# EAGLE design TD4Peripheral (EAGLE 9.2.2)
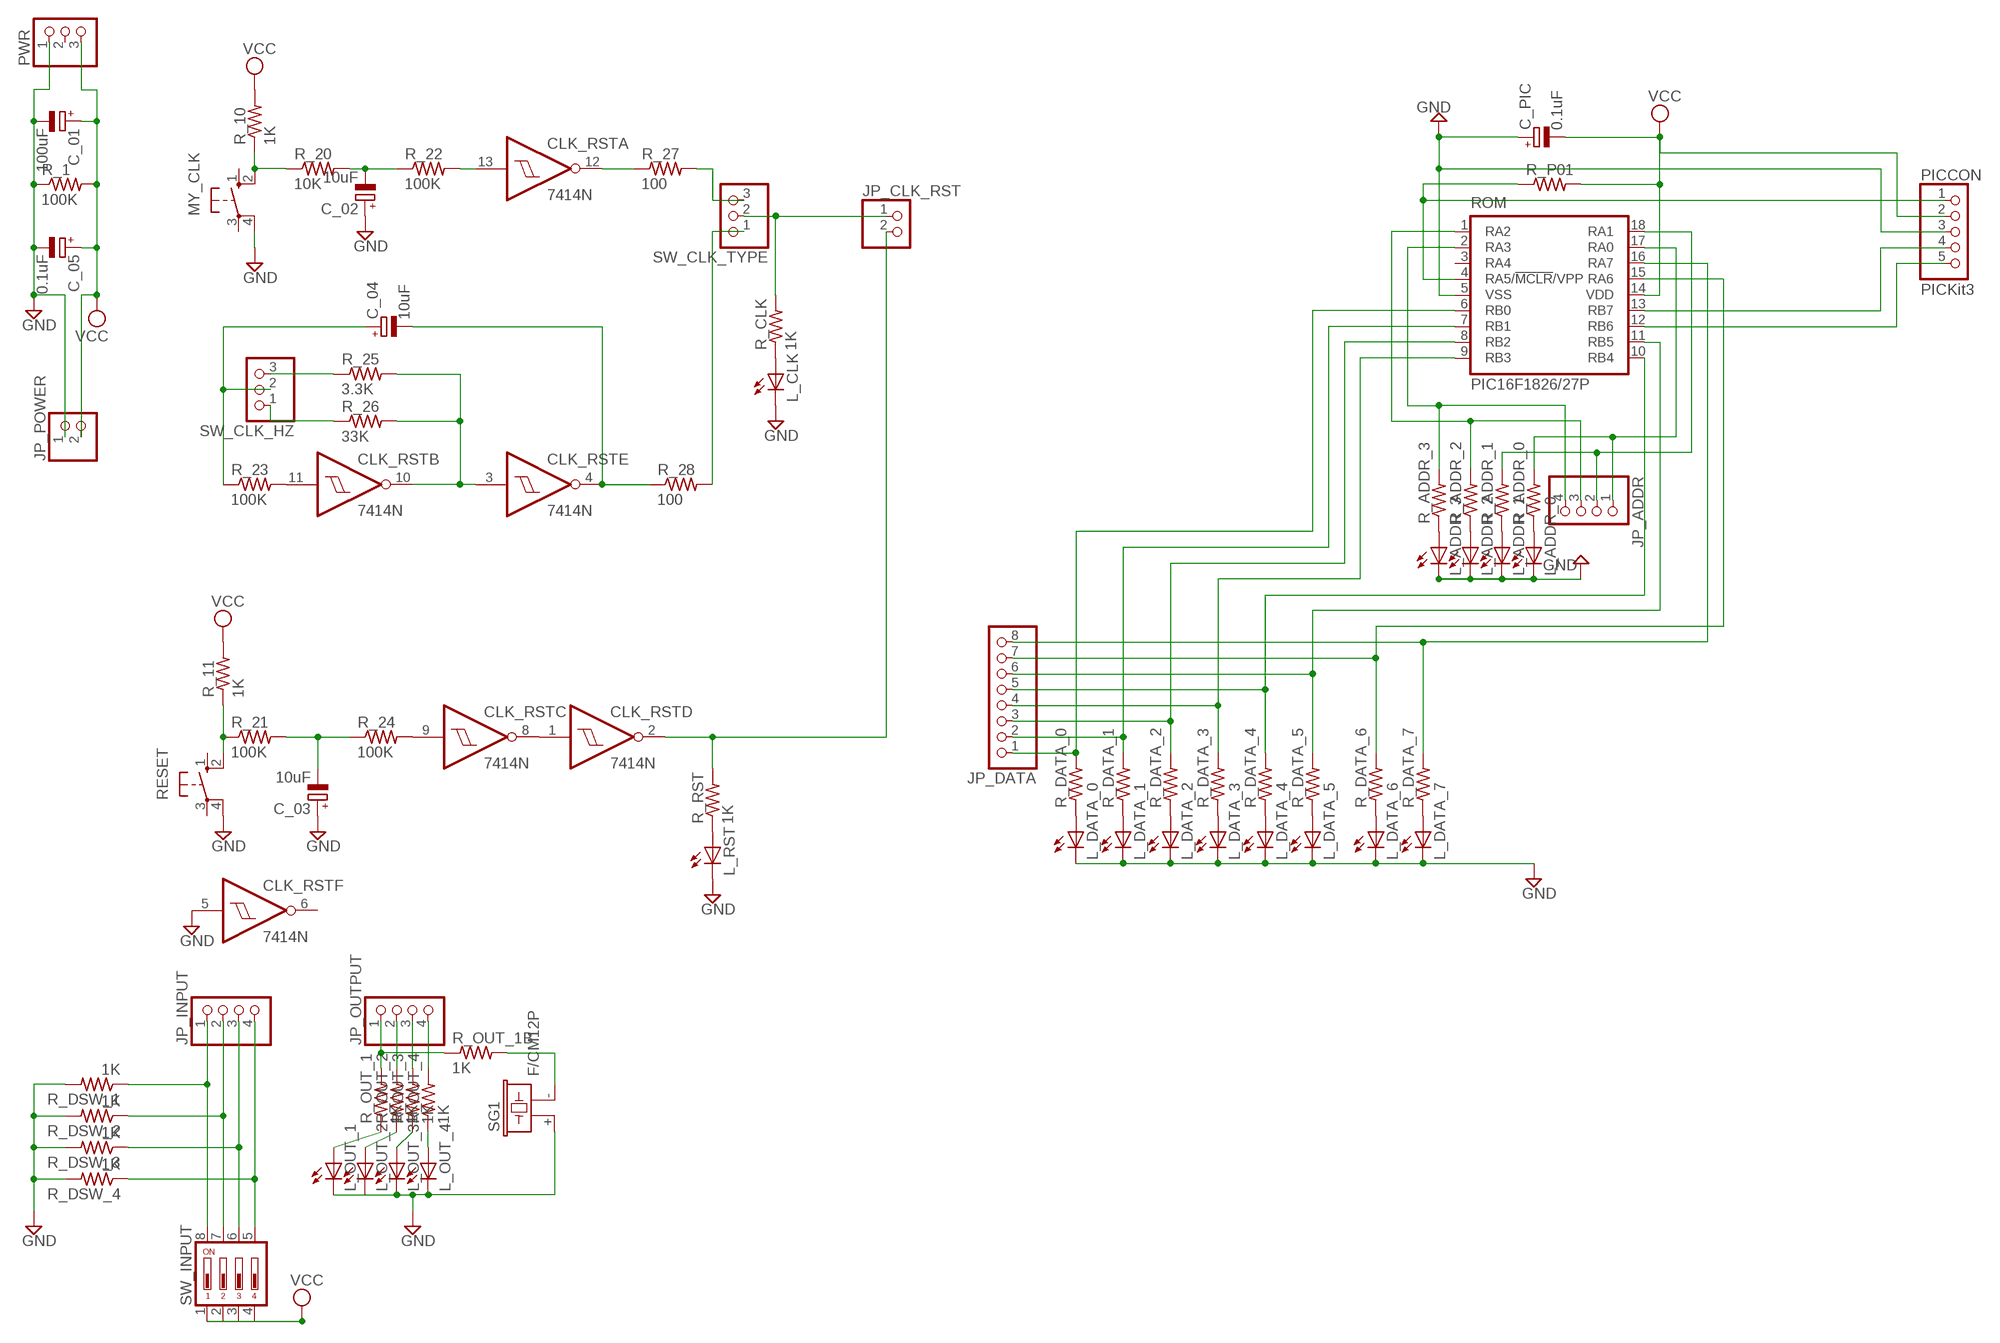
[diagram p0: schematic, sheet 1]

## Parts
C_01  100uF  CPOL-EUE2-5  [E2-5]
C_02  10uF  CPOL-EUE2-5  [E2-5]
C_03  10uF  CPOL-EUE2-5  [E2-5]
C_04  10uF  CPOL-EUE2-5  [E2-5]
C_05  0.1uF  CPOL-EUE2-5  [E2-5]
C_PIC  0.1uF  CPOL-EUE2-5  [E2-5]
CLK_RST  7414N  [DIL14]
JP_ADDR  PINHD-1X4  [1X04]
JP_CLK_RST  PINHD-1X2  [1X02]
JP_DATA  PINHD-1X8  [1X08]
JP_INPUT  PINHD-1X4  [1X04]
JP_OUTPUT  PINHD-1X4  [1X04]
JP_POWER  PINHD-1X2  [1X02]
L_ADDR_0  LED5MM  [LED5MM]
L_ADDR_1  LED5MM  [LED5MM]
L_ADDR_2  LED5MM  [LED5MM]
L_ADDR_3  LED5MM  [LED5MM]
L_CLK  LED5MM  [LED5MM]
L_DATA_0  LED5MM  [LED5MM]
L_DATA_1  LED5MM  [LED5MM]
L_DATA_2  LED5MM  [LED5MM]
L_DATA_3  LED5MM  [LED5MM]
L_DATA_4  LED5MM  [LED5MM]
L_DATA_5  LED5MM  [LED5MM]
L_DATA_6  LED5MM  [LED5MM]
L_DATA_7  LED5MM  [LED5MM]
L_OUT_1  LED5MM  [LED5MM]
L_OUT_2  LED5MM  [LED5MM]
L_OUT_3  LED5MM  [LED5MM]
L_OUT_4  LED5MM  [LED5MM]
L_RST  LED5MM  [LED5MM]
MY_CLK  10-XX  [B3F-10XX]
PICCON  PICKit3  PINHD-1X5  [1X05]
PWR  PINHD-1X3  [1X03]
R_1  100K  R-US_0204/7  [0204/7]
R_10  1K  R-US_0204/7  [0204/7]
R_11  1K  R-US_0204/7  [0204/7]
R_20  10K  R-US_0204/7  [0204/7]
R_21  100K  R-US_0204/7  [0204/7]
R_22  100K  R-US_0204/7  [0204/7]
R_23  100K  R-US_0204/7  [0204/7]
R_24  100K  R-US_0204/7  [0204/7]
R_25  3.3K  R-US_0204/7  [0204/7]
R_26  33K  R-US_0204/7  [0204/7]
R_27  100  R-US_0204/7  [0204/7]
R_28  100  R-US_0204/7  [0204/7]
R_ADDR_0  R-US_0204/7  [0204/7]
R_ADDR_1  R-US_0204/7  [0204/7]
R_ADDR_2  R-US_0204/7  [0204/7]
R_ADDR_3  R-US_0204/7  [0204/7]
R_CLK  1K  R-US_0204/7  [0204/7]
R_DATA_0  R-US_0204/7  [0204/7]
R_DATA_1  R-US_0204/7  [0204/7]
R_DATA_2  R-US_0204/7  [0204/7]
R_DATA_3  R-US_0204/7  [0204/7]
R_DATA_4  R-US_0204/7  [0204/7]
R_DATA_5  R-US_0204/7  [0204/7]
R_DATA_6  R-US_0204/7  [0204/7]
R_DATA_7  R-US_0204/7  [0204/7]
R_DSW_1  1K  R-US_0204/7  [0204/7]
R_DSW_2  1K  R-US_0204/7  [0204/7]
R_DSW_3  1K  R-US_0204/7  [0204/7]
R_DSW_4  1K  R-US_0204/7  [0204/7]
R_OUT_1  1K  R-US_0204/7  [0204/7]
R_OUT_1B  1K  R-US_0204/7  [0204/7]
R_OUT_2  1K  R-US_0204/7  [0204/7]
R_OUT_3  1K  R-US_0204/7  [0204/7]
R_OUT_4  1K  R-US_0204/7  [0204/7]
R_P01  R-US_0204/7  [0204/7]
R_RST  1K  R-US_0204/7  [0204/7]
RESET  10-XX  [B3F-10XX]
ROM  PIC16F1826/27P  [DIL18]
SG1  F/CM12P  [F/CM12P]
SW_CLK_HZ  PINHD-1X3  [1X03]
SW_CLK_TYPE  PINHD-1X3  [1X03]
SW_INPUT  DP04  [DP-04]

## Nets
ADDR_0: JP_ADDR.1 R_ADDR_0.2 ROM.17(RA0)
ADDR_1: JP_ADDR.2 R_ADDR_1.2 ROM.18(RA1)
ADDR_2: JP_ADDR.3 R_ADDR_2.2 ROM.1(RA2)
ADDR_3: JP_ADDR.4 R_ADDR_3.2 ROM.2(RA3)
DATA_0: JP_DATA.1 R_DATA_0.2 ROM.6(RB0)
DATA_1: JP_DATA.2 R_DATA_1.2 ROM.7(RB1)
DATA_2: JP_DATA.3 R_DATA_2.2 ROM.8(RB2)
DATA_3: JP_DATA.4 R_DATA_3.2 ROM.9(RB3)
DATA_4: JP_DATA.5 R_DATA_4.2 ROM.10(RB4)
DATA_5: JP_DATA.6 R_DATA_5.2 ROM.11(RB5)
DATA_6: JP_DATA.7 R_DATA_6.2 ROM.15(RA6)
DATA_7: JP_DATA.8 R_DATA_7.2 ROM.16(RA7)
GND: C_01.- C_02.+ C_03.+ C_05.- C_PIC.+ CLK_RST.5(F:I) JP_POWER.1 L_ADDR_0.K(C) L_ADDR_1.K(C) L_ADDR_2.K(C) L_ADDR_3.K(C) L_CLK.K(C) L_DATA_0.K(C) L_DATA_1.K(C) L_DATA_2.K(C) L_DATA_3.K(C) L_DATA_4.K(C) L_DATA_5.K(C) L_DATA_6.K(C) L_DATA_7.K(C) L_OUT_1.K(C) L_OUT_2.K(C) L_OUT_3.K(C) L_OUT_4.K(C) L_RST.K(C) MY_CLK.4(P1) PICCON.3 PWR.1 R_1.1 R_DSW_1.2 R_DSW_2.2 R_DSW_3.2 R_DSW_4.2 RESET.4(P1) ROM.5(VSS) SG1.+
ICSPCLK: PICCON.5 ROM.12(RB6)
ICSPDAT: PICCON.4 ROM.13(RB7)
MCLR: PICCON.1 R_P01.1 ROM.4(RA5/!MCLR!/VPP)
N$1: MY_CLK.2(S1) R_10.1 R_20.1
N$2: C_02.- R_20.2 R_22.1
N$3: CLK_RST.13(A:I) R_22.2
N$4: CLK_RST.12(A:O) R_27.1
N$5: R_27.2 SW_CLK_TYPE.3
N$6: C_04.+ R_23.1 SW_CLK_HZ.2
N$7: R_25.1 SW_CLK_HZ.3
N$8: R_26.1 SW_CLK_HZ.1
N$9: CLK_RST.11(B:I) R_23.2
N$10: CLK_RST.3(E:I) CLK_RST.10(B:O) R_25.2 R_26.2
N$11: R_28.2 SW_CLK_TYPE.1
N$12: C_04.- CLK_RST.4(E:O) R_28.1
N$13: R_11.1 R_21.1 RESET.2(S1)
N$14: C_03.- R_21.2 R_24.1
N$15: CLK_RST.9(C:I) R_24.2
N$16: CLK_RST.1(D:I) CLK_RST.8(C:O)
N$21: CLK_RST.2(D:O) JP_CLK_RST.2 R_RST.2
N$22: JP_CLK_RST.1 R_CLK.2 SW_CLK_TYPE.2
N$34: L_DATA_7.A R_DATA_7.1
N$35: L_DATA_6.A R_DATA_6.1
N$36: L_DATA_5.A R_DATA_5.1
N$37: L_DATA_4.A R_DATA_4.1
N$42: L_DATA_3.A R_DATA_3.1
N$43: L_DATA_2.A R_DATA_2.1
N$44: L_DATA_1.A R_DATA_1.1
N$48: L_ADDR_0.A R_ADDR_0.1
N$50: L_ADDR_1.A R_ADDR_1.1
N$51: L_ADDR_2.A R_ADDR_2.1
N$63: L_CLK.A R_CLK.1
N$64: L_RST.A R_RST.1
N$65: L_ADDR_3.A R_ADDR_3.1
N$66: L_DATA_0.A R_DATA_0.1
N_OUT1: JP_OUTPUT.1 R_OUT_1.2 R_OUT_1B.1
N_OUT2: JP_OUTPUT.2 R_OUT_2.2
N_OUT3: JP_OUTPUT.3 R_OUT_3.2
N_OUT4: JP_OUTPUT.4 R_OUT_4.2
N_OUT_1: L_OUT_1.A R_OUT_1.1
N_OUT_1B: R_OUT_1B.2 SG1.-
N_OUT_2: L_OUT_2.A R_OUT_2.1
N_OUT_3: L_OUT_3.A R_OUT_3.1
N_OUT_4: L_OUT_4.A R_OUT_4.1
N_SW1: JP_INPUT.1 R_DSW_1.1 SW_INPUT.8
N_SW2: JP_INPUT.2 R_DSW_2.1 SW_INPUT.7
N_SW3: JP_INPUT.3 R_DSW_3.1 SW_INPUT.6
N_SW4: JP_INPUT.4 R_DSW_4.1 SW_INPUT.5
VCC: C_01.+ C_05.+ C_PIC.- JP_POWER.2 PICCON.2 PWR.3 R_1.2 R_10.2 R_11.2 R_P01.2 ROM.14(VDD) SW_INPUT.1 SW_INPUT.2 SW_INPUT.3 SW_INPUT.4
Unconnected: CLK_RST.6(F:O) MY_CLK.1(S) MY_CLK.3(P) PWR.2 RESET.1(S) RESET.3(P) ROM.3(RA4)

## Power pins joined to a net without a drawn wire
GND: CLK_RST.7(P:GND)
VCC: CLK_RST.14(P:VCC)

## Library data of the parts
C_01-C_05 C_PIC = rcl:CPOL-EU: POLARIZED CAPACITOR, European symbol; SPICEPREFIX: C
CLK_RST = 74xx-us:74*14: Hex schmitt trigger INVERTER
JP_ADDR JP_INPUT JP_OUTPUT = pinhead:PINHD-1X4: PIN HEADER
JP_CLK_RST JP_POWER = pinhead:PINHD-1X2: PIN HEADER
JP_DATA = pinhead:PINHD-1X8: PIN HEADER
L_ADDR_0 L_ADDR_1-L_ADDR_3 L_CLK L_DATA_0 L_DATA_1-L_DATA_7 L_OUT_1-L_OUT_4 L_RST = led:LED: LED OSRAM: - CHIPLED LG R971, LG N971, LY N971, LG Q971, LY Q971, LO R971, LY R971 LH N974, LH R974 LS Q976, LO Q976, LY Q976 LO Q996 - Hyper CHIPLED LW Q18S LB Q993, LB Q99A, LB R99A - SideLED LS A670, LO A670, LY A670, LG A670, LP A670 LB A673, LV A673, LT A673, LW A673 LH A674 LY A675 LS A676, LA A676, LO A676, LY A676, LW A676 LS A679, LY A679, LG A679 - Hyper Micro SIDELED® LS Y876, LA Y876, LO Y876, LY Y876 LT Y87S - SmartLED LW L88C, LW L88S LB L89C, LB L89S, LG L890 LS L89K, LO L89K, LY L89K LS L896, LA L896, LO L896, LY L896 - TOPLED LS T670, LO T670, LY T670, LG T670, LP T670 LSG T670, LSP T670, LSY T670, LOP T670, LYG T670 LG T671, LOG T671, LSG T671 LB T673, LV T673, LT T673, LW T673 LH T674 LS T676, LA T676, LO T676, LY T676, LB T676, LH T676, LSB T676, LW T676 LB T67C, LV T67C, LT T67C, LS T67K, LO T67K, LY T67K, LW E67C LS E67B, LA E67B, LO E67B, LY E67B, LB E67C, LV E67C, LT E67C LW T67C LS T679, LY T679, LG T679 LS T770, LO T770, LY T770, LG T770, LP T770 LB T773, LV T773, LT T773, LW T773 LH T774 LS E675, LA E675, LY E675, LS T675 LS T776, LA T776, LO T776, LY T776, LB T776 LHGB T686 LT T68C, LB T68C - Hyper Mini TOPLED® LB M676 - Mini TOPLED Santana® LG M470 LS M47K, LO M47K, LY M47K Source: http://www.osram.convergy.de LUXEON: - LUMILED® LXK2-PW12-R00, LXK2-PW12-S00, LXK2-PW14-U00, LXK2-PW14-V00 LXK2-PM12-R00, LXK2-PM12-S00, LXK2-PM14-U00 LXK2-PE12-Q00, LXK2-PE12-R00, LXK2-PE12-S00, LXK2-PE14-T00, LXK2-PE14-U00 LXK2-PB12-K00, LXK2-PB12-L00, LXK2-PB12-M00, LXK2-PB14-N00, LXK2-PB14-P00, LXK2-PB14-Q00 LXK2-PR12-L00, LXK2-PR12-M00, LXK2-PR14-Q00, LXK2-PR14-R00 LXK2-PD12-Q00, LXK2-PD12-R00, LXK2-PD12-S00 LXK2-PH12-R00, LXK2-PH12-S00 LXK2-PL12-P00, LXK2-PL12-Q00, LXK2-PL12-R00 Source: www.luxeon.com KINGBRIGHT: KA-3528ASYC Source: www.kingbright.com
MY_CLK RESET = switch-omron:10-XX: OMRON SWITCH; MPN: B3F-1000; OC_FARNELL: 176432; OC_NEWARK: 36M3542
PICCON = pinhead:PINHD-1X5: PIN HEADER
PWR SW_CLK_HZ SW_CLK_TYPE = pinhead:PINHD-1X3: PIN HEADER
R_1 R_10 R_11 R_20-R_28 R_ADDR_0 R_ADDR_1-R_ADDR_3 R_CLK R_DATA_0 R_DATA_1-R_DATA_7 R_DSW_1-R_DSW_4 R_OUT_1 R_OUT_1B R_OUT_2-R_OUT_4 R_P01 R_RST = rcl:R-US_: RESISTOR, American symbol; SPICEPREFIX: R
ROM = microchip:PIC16*F1826/27: 18/20/28-Pin Flash Microcontrollers with nanoWatt XLP Technology Source: www.microchip.com PIC16F1827.pdf
SG1 = buzzer:F/CM12P: BUZZER Source: Buerklin; OC_FARNELL: unknown; OC_NEWARK: unknown
SW_INPUT = switch-dil:DP04: DIL/CODE SWITCH; MPN: DP04; OC_FARNELL: 9471600; OC_NEWARK: 73J0027

## Board
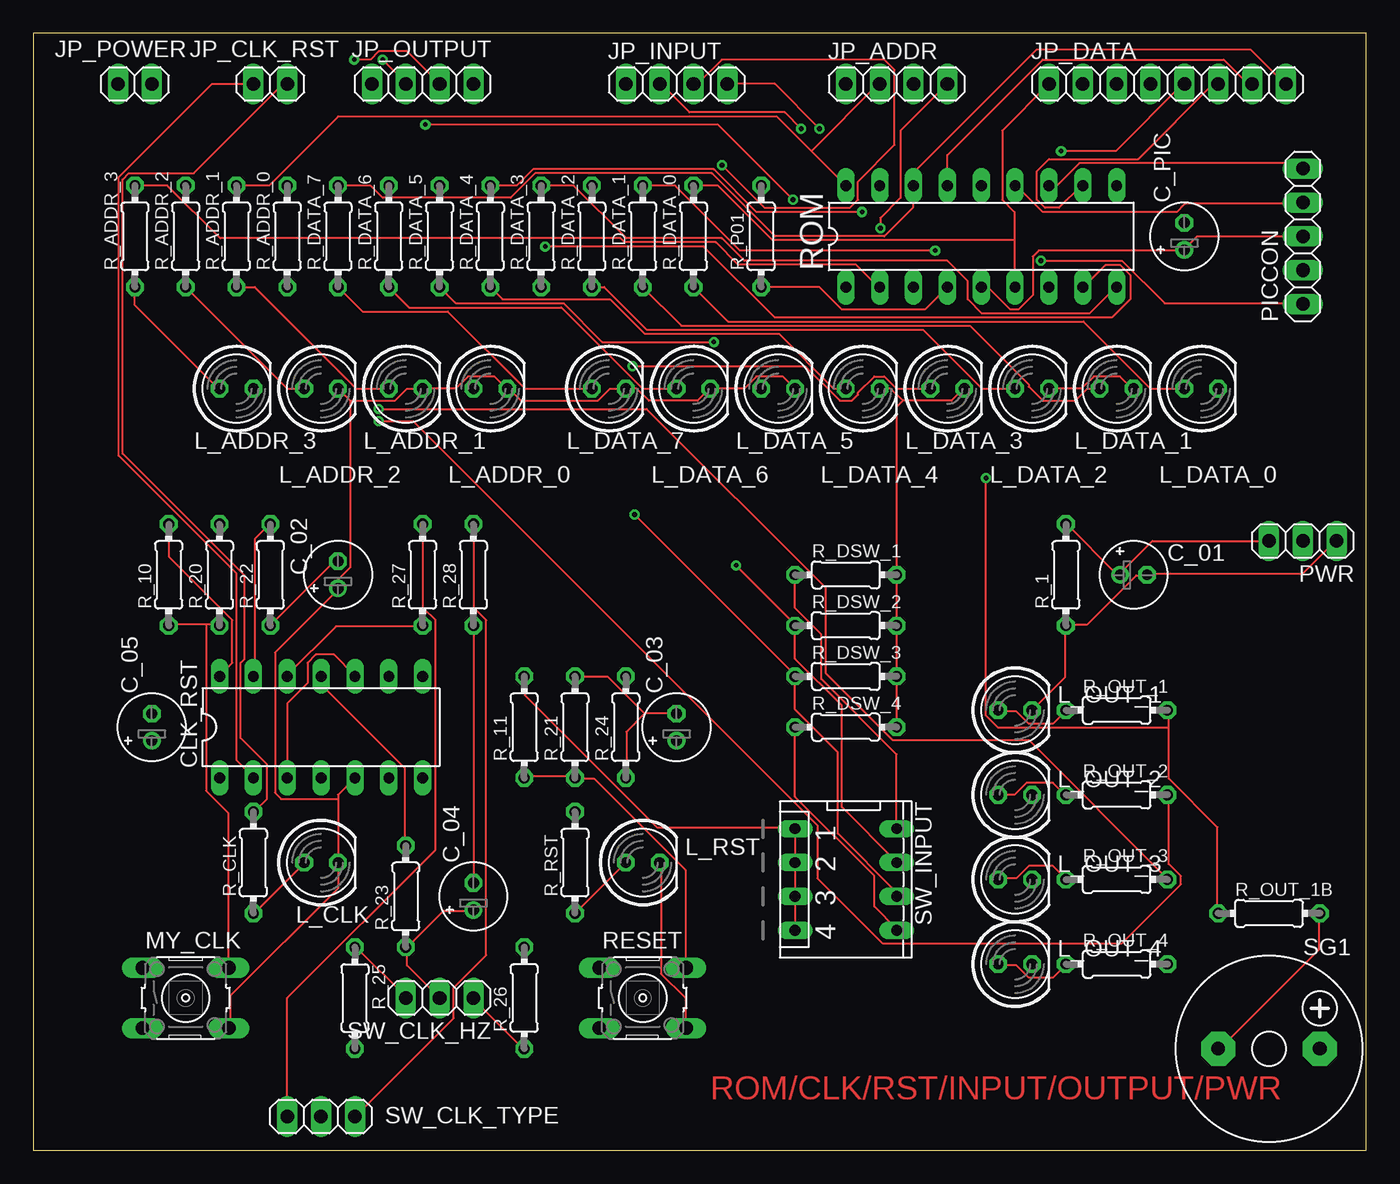
[diagram p1: board, top side]
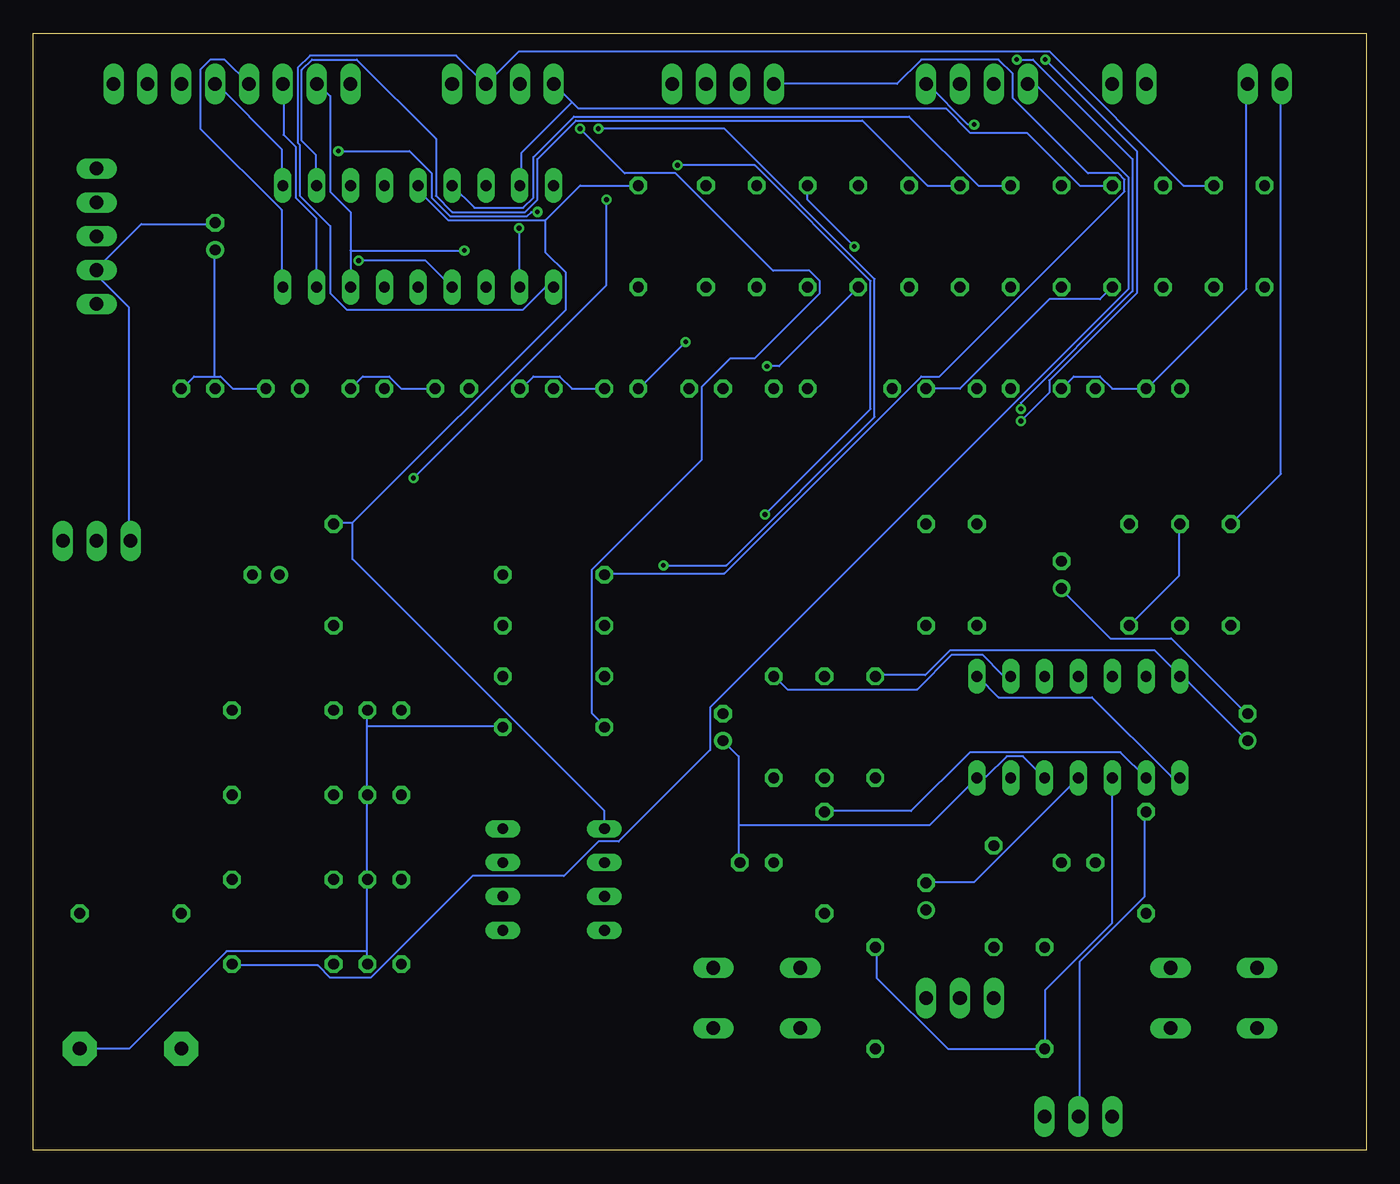
[diagram p2: board, bottom side, seen from below]

Size 100 x 83.81 mm. Coordinates in mm from the lower left corner, seen from the top.
Outline: 0,0 100,0 100,83.81 0,83.81 0,0
Copper layers (1*16): Top 0.035mm / dielectric 1.5mm / Bottom 0.035mm
Design rules "default": minimum track width 6mil, minimum drill 0.35mm, track to track 6mil, track to pad 6mil, pad to pad 6mil, via to via 6mil, smd to smd 6mil, copper to edge 40mil, drill to drill 6mil, minimum pad ring 10mil, minimum via ring 8mil, stop-mask expansion 4mil, vias tented up to drill 0mil, thermal gap 10mil

### Footprints (pad centres in the part's own frame; a part is rotated, then mirrored left to right if it is on the bottom)
E2-5 = drill 0.813 pad 1.27: + -1.016,0 | drill 0.813 pad 1.27 octagon: - 1.016,0
DIL14 = drill 0.813 long: 1 -7.62,-3.81; 2 -5.08,-3.81; 3 -2.54,-3.81; 4 0,-3.81; 5 2.54,-3.81; 6 5.08,-3.81; 7 7.62,-3.81; 8 7.62,3.81; 9 5.08,3.81; 10 2.54,3.81; 11 0,3.81; 12 -2.54,3.81; 13 -5.08,3.81; 14 -7.62,3.81
1X04 = drill 1.016 long: 1 -3.81,0; 2 -1.27,0; 3 1.27,0; 4 3.81,0
1X02 = drill 1.016 long: 1 -1.27,0; 2 1.27,0
1X08 = drill 1.016 long: 1 -8.89,0; 2 -6.35,0; 3 -3.81,0; 4 -1.27,0; 5 1.27,0; 6 3.81,0; 7 6.35,0; 8 8.89,0
LED5MM = drill 0.813 octagon: A -1.27,0; K 1.27,0
B3F-10XX = drill 1.016 long: 1 -3.251,2.261; 2 3.251,2.261; 3 -3.251,-2.261; 4 3.251,-2.261
1X05 = drill 1.016 long: 1 -5.08,0; 2 -2.54,0; 3 0,0; 4 2.54,0; 5 5.08,0
1X03 = drill 1.016 long: 1 -2.54,0; 2 0,0; 3 2.54,0
0204/7 = drill 0.813 octagon: 1 -3.81,0; 2 3.81,0
DIL18 = drill 0.813 long: 1 -10.16,-3.81; 2 -7.62,-3.81; 3 -5.08,-3.81; 4 -2.54,-3.81; 5 0,-3.81; 6 2.54,-3.81; 7 5.08,-3.81; 8 7.62,-3.81; 9 10.16,-3.81; 10 10.16,3.81; 11 7.62,3.81; 12 5.08,3.81; 13 2.54,3.81; 14 0,3.81; 15 -2.54,3.81; 16 -5.08,3.81; 17 -7.62,3.81; 18 -10.16,3.81
F/CM12P = drill 1.016 pad 2.54 octagon: + 3.81,0; - -3.81,0
DP-04 = drill 0.813 long: 1 -3.81,-3.81; 2 -1.27,-3.81; 3 1.27,-3.81; 4 3.81,-3.81; 5 3.81,3.81; 6 1.27,3.81; 7 -1.27,3.81; 8 -3.81,3.81

### Placement (x,y rotation side)
C_01  82.55,43.18 0 top
C_02  22.86,43.18 90 top
C_03  48.26,31.75 90 top
C_04  33.02,19.05 90 top
C_05  8.89,31.75 90 top
C_PIC  86.36,68.58 90 top
CLK_RST  21.59,31.75 0 top
JP_ADDR  64.77,80.01 0 top
JP_CLK_RST  17.78,80.01 180 top
JP_DATA  85.09,80.01 0 top
JP_INPUT  48.26,80.01 0 top
JP_OUTPUT  29.21,80.01 180 top
JP_POWER  7.62,80.01 180 top
L_ADDR_0  34.29,57.15 0 top
L_ADDR_1  27.94,57.15 0 top
L_ADDR_2  21.59,57.15 0 top
L_ADDR_3  15.24,57.15 0 top
L_CLK  21.59,21.59 0 top
L_DATA_0  87.63,57.15 0 top
L_DATA_1  81.28,57.15 0 top
L_DATA_2  74.93,57.15 0 top
L_DATA_3  68.58,57.15 0 top
L_DATA_4  62.23,57.15 0 top
L_DATA_5  55.88,57.15 0 top
L_DATA_6  49.53,57.15 0 top
L_DATA_7  43.18,57.15 0 top
L_OUT_1  73.66,33.02 0 top
L_OUT_2  73.66,26.67 0 top
L_OUT_3  73.66,20.32 0 top
L_OUT_4  73.66,13.97 0 top
L_RST  45.72,21.59 0 top
MY_CLK  11.43,11.43 0 top
PICCON  95.25,68.58 90 top
PWR  95.25,45.72 180 top
R_1  77.47,43.18 90 top
R_10  10.16,43.18 90 top
R_11  36.83,31.75 90 top
R_20  13.97,43.18 90 top
R_21  40.64,31.75 90 top
R_22  17.78,43.18 90 top
R_23  27.94,19.05 90 top
R_24  44.45,31.75 90 top
R_25  24.13,11.43 270 top
R_26  36.83,11.43 90 top
R_27  29.21,43.18 90 top
R_28  33.02,43.18 90 top
R_ADDR_0  19.05,68.58 90 top
R_ADDR_1  15.24,68.58 90 top
R_ADDR_2  11.43,68.58 90 top
R_ADDR_3  7.62,68.58 90 top
R_CLK  16.51,21.59 90 top
R_DATA_0  49.53,68.58 90 top
R_DATA_1  45.72,68.58 90 top
R_DATA_2  41.91,68.58 90 top
R_DATA_3  38.1,68.58 90 top
R_DATA_4  34.29,68.58 90 top
R_DATA_5  30.48,68.58 90 top
R_DATA_6  26.67,68.58 90 top
R_DATA_7  22.86,68.58 90 top
R_DSW_1  60.96,43.18 0 top
R_DSW_2  60.96,39.37 0 top
R_DSW_3  60.96,35.56 0 top
R_DSW_4  60.96,31.75 0 top
R_OUT_1  81.28,33.02 0 top
R_OUT_1B  92.71,17.78 0 top
R_OUT_2  81.28,26.67 0 top
R_OUT_3  81.28,20.32 0 top
R_OUT_4  81.28,13.97 0 top
R_P01  54.61,68.58 90 top
R_RST  40.64,21.59 90 top
RESET  45.72,11.43 0 top
ROM  71.12,68.58 0 top
SG1  92.71,7.62 0 top
SW_CLK_HZ  30.48,11.43 180 top
SW_CLK_TYPE  21.59,2.54 180 top
SW_INPUT  60.96,20.32 270 top

### Tracks (layer width: path | path; a pad name or v marks a point on that pad's centre or on a via)
ADDR_0
  Bottom 0.152: R_ADDR_0.2 21.49,72.39 25.45,76.35 29.72,76.35 31.55,78.18 59.13,78.18 59.59,78.64 | JP_ADDR.1 59.59,78.64 | 59.59,78.64 63.4,74.83 63.4,72.39 ROM.17
ADDR_1
  Top 0.152: R_ADDR_1.2 17.68,72.39 22.86,77.57 55.78,77.57 58.37,74.98 | ROM.18 58.37,74.98 | 58.37,74.98 63.4,80.01 JP_ADDR.2
ADDR_2
  Bottom 0.152: ROM.1 61.57,64.77 63.25,63.09 76.5,63.09 77.72,64.31 77.72,69.34 80.01,71.63 80.01,75.44 80.16,75.59 80.16,81.23 79.25,82.14 68.28,82.14 66.14,80.01 JP_ADDR.3 65.99,80.01 63.55,82.45 23.77,82.45 13.72,72.39 R_ADDR_2.2
ADDR_3  (via drill 0.35)
  Top 0.152: v63.55,69.19 63.55,69.95 65.08,71.48 65.08,76.5 JP_ADDR.4 | R_ADDR_3.2 10.06,72.39 14.02,68.43 44.04,68.43 44.35,68.12 51.21,68.12 52.88,66.45 61.72,66.45 63.4,64.77 ROM.2
  Bottom 0.152: v63.55,69.19 63.55,64.77 ROM.2
DATA_0
  Top 0.152: 73.61,68.28 73.61,70.41 72.69,71.32 72.69,76.5 JP_DATA.1 | 73.61,68.28 73.61,64.77 ROM.6 | R_DATA_0.2 51.36,72.39 55.47,68.28 73.61,68.28
DATA_1  (via drill 0.35)
  Top 0.152: R_DATA_1.2 48.16,72.39 53.03,67.51 v67.67,67.51
  Bottom 0.152: 76.2,67.51 76.2,70.41 77.72,71.93 77.72,79.1 78.64,80.01 JP_DATA.2 | 76.2,67.51 ROM.7 | 76.2,67.51 v67.67,67.51
DATA_2  (via drill 0.35)
  Top 0.152: v38.41,67.82 50.29,67.82 55.63,62.48 80.92,62.48 82.3,63.86 82.3,65.68 81.53,66.45 80.47,66.45 78.79,64.77 ROM.8
  Bottom 0.152: ROM.8 78.79,64.77 78.79,69.95 80.31,71.48 80.31,75.29 81.23,76.2 81.23,80.01 JP_DATA.3 | R_DATA_2.2 41.91,71.32 v38.41,67.82
DATA_3
  Top 0.152: R_DATA_3.2 40.54,72.39 44.5,68.43 51.66,68.43 53.34,66.75 68.58,66.75 70.1,65.23 70.1,63.86 71.17,62.79 79.25,62.79 81.23,64.77 ROM.9
  Bottom 0.152: JP_DATA.4 85.65,81.84 86.72,81.84 87.48,81.08 87.48,76.66 81.38,70.56 81.38,64.77 ROM.9
DATA_4  (via drill 0.35)
  Top 0.152: R_DATA_4.2 36.27,72.39 37.49,73.61 51.05,73.61 54.25,70.41 v62.18,70.41 | v77.11,74.98 81.23,74.98 86.26,80.01 JP_DATA.5
  Bottom 0.152: v62.18,70.41 62.64,70.41 62.94,70.1 68.73,70.1 70.1,71.48 70.1,73.3 71.78,74.98 v77.11,74.98 | ROM.10 81.38,72.39 81.38,75.13 86.26,80.01 JP_DATA.5
DATA_5
  Top 0.152: JP_DATA.6 88.54,80.01 82.91,74.37 76.2,74.37 75.29,73.46 75.29,71.32 75.89,70.71 76.96,70.71 78.64,72.39 ROM.11
  Bottom 0.152: R_DATA_5.2 32.92,72.39 37.8,77.27 59.28,77.27 62.18,74.37 62.18,71.32 63.09,70.41 68.58,70.41 69.8,71.63 69.8,75.89 75.74,81.84 79.1,81.84 79.86,81.08 79.86,75.74 78.79,74.68 78.79,72.39 ROM.11
DATA_6
  Top 0.152: JP_DATA.7 91.14,80.01 89.31,81.84 75.74,81.84 68.58,74.68 ROM.15
  Bottom 0.152: R_DATA_6.2 29.11,72.39 34.29,77.57 59.44,77.57 62.48,74.52 62.48,71.48 63.25,70.71 66.9,70.71 ROM.15
DATA_7
  Top 0.152: R_DATA_7.2 25.3,72.39 26.21,71.48 35.81,71.48 37.64,73.3 50.9,73.3 55.63,68.58 63.86,68.58 65.99,70.71 65.99,72.39 ROM.16 66.14,72.39 66.14,73.46 75.29,82.6 91.29,82.6 93.88,80.01 JP_DATA.8
GND
  Top 0.152: R_DSW_4.2 R_DSW_3.2 R_DSW_2.2 R_DSW_1.2 64.77,55.78 65.23,56.24 | L_OUT_1.K 77.42,35.51 77.42,39.32 R_1.1 77.57,39.47 79.1,39.47 82.75,43.13 83.52,43.13 C_01.- 83.67,43.28 95.25,43.28 97.69,45.72 PWR.1 | ROM.5 71.63,64.77 73.3,63.09 73.91,63.09 74.98,64.16 74.98,67.06 75.44,67.51 86.26,67.51 C_PIC.+ 86.41,67.67 87.33,68.58 PICCON.3 | L_DATA_5.K 56.24,58.06 54.25,58.06 53.34,57.15 L_DATA_6.K 50.75,57.15 49.84,56.24 46.18,56.24 45.26,57.15 L_DATA_7.K 43.28,57.15 42.37,56.24 36.58,56.24 35.66,57.15 L_ADDR_0.K 35.51,57.15 34.59,58.06 32.61,58.06 31.7,57.15 L_ADDR_1.K 28.04,57.15 27.13,56.24 23.77,56.24 | L_DATA_2.K 78.64,57.15 79.55,58.06 81.53,58.06 82.45,57.15 L_DATA_1.K | L_DATA_4.K 64.31,57.15 65.23,56.24 | 65.23,56.24 68.89,56.24 69.8,57.15 L_DATA_3.K | RESET.4 48.92,9.3 48.92,11.43 47.09,13.26 47.09,21.49 L_RST.K | 22.86,26.36 22.86,26.67 CLK_RST.5 | 22.86,26.36 L_CLK.K 22.86,19.66 14.78,11.58 14.78,9.3 MY_CLK.4 | L_ADDR_2.K 23.77,56.24 | 23.77,56.24 23.77,43.74 22.86,42.82 C_02.+ 22.86,42.06 18.14,37.34 18.14,26.82 18.59,26.36 22.86,26.36
  Bottom 0.152: 74.98,14.94 74.98,20.27 L_OUT_3.K 74.98,20.42 74.98,26.67 | 74.98,14.94 74.98,14.02 L_OUT_4.K | 74.98,31.85 74.98,32.92 L_OUT_1.K | 74.98,31.85 74.98,26.67 | 74.98,26.67 L_OUT_2.K | SG1.+ 92.81,7.62 85.5,14.94 74.98,14.94 | 74.98,31.85 64.77,31.85 R_DSW_4.2 | L_DATA_5.K 59.59,57.15 60.5,58.06 62.48,58.06 63.4,57.15 L_DATA_4.K | L_DATA_3.K 72.39,57.15 73.3,58.06 75.29,58.06 L_DATA_2.K | L_DATA_1.K 85.04,57.15 85.95,58.06 86.41,58.06 | 86.41,58.06 87.94,58.06 88.85,57.15 L_DATA_0.K | 86.41,58.06 86.41,67.51 C_PIC.+ | 47.09,24.38 47.09,29.57 C_03.+ | 47.09,24.38 47.09,21.64 L_RST.K | CLK_RST.5 25.76,29.57 26.98,29.57 28.5,28.04 29.11,28.04 CLK_RST.7 32.77,24.38 47.09,24.38 | C_05.- 8.99,32.77 14.63,38.41 19.2,38.41 22.86,42.06 C_02.+ | L_ADDR_2.K 21.95,58.06 19.96,58.06 19.05,57.15 L_ADDR_3.K 16.46,57.15 8.99,64.62 8.99,80.01 JP_POWER.1
ICSPCLK
  Top 0.152: ROM.12 76.81,72.39 78.49,74.07 94.94,74.07 95.25,73.76 PICCON.5
ICSPDAT
  Top 0.152: ROM.13 73.76,72.39 75.74,70.41 85.8,70.41 86.41,71.02 95.25,71.02 PICCON.4
MCLR  (via drill 0.35)
  Top 0.152: R_P01.1 58.98,64.77 60.66,63.09 66.9,63.09 ROM.4 | v75.59,66.75 81.69,66.75 84.89,63.55 95.25,63.55 PICCON.1
  Bottom 0.152: v75.59,66.75 70.56,66.75 ROM.4
N$1
  Top 0.152: 12.95,39.47 13.87,39.47 R_20.1 | 12.95,39.47 10.21,39.47 R_10.1 | 12.95,39.47 12.95,26.98 14.63,25.3 14.63,13.72 MY_CLK.2
N$2
  Top 0.152: C_02.- 22.55,44.2 17.83,39.47 R_22.1
  Bottom 0.152: R_22.1 14.02,43.13 14.02,46.94 R_20.2
N$3
  Top 0.152: CLK_RST.13 16.61,35.66 16.61,45.87 17.68,46.94 R_22.2
N$4
  Top 0.152: CLK_RST.12 19.05,35.66 22.71,39.32 29.11,39.32 R_27.1
N$5
  Top 0.152: SW_CLK_TYPE.3 19.05,11.43 30.18,22.55 30.18,39.78 29.26,40.69 29.26,46.94 R_27.2
N$6
  Top 0.152: 28.04,15.24 28.04,13.87 SW_CLK_HZ.2 | 28.04,15.24 30.79,17.98 32.92,17.98 C_04.+ | 28.04,15.24 R_23.1
N$7
  Top 0.152: R_25.1 24.23,15.24 28.04,11.43 SW_CLK_HZ.3
N$8
  Top 0.152: R_26.1 36.73,7.62 32.92,11.43 SW_CLK_HZ.1
N$9
  Top 0.152: CLK_RST.11 21.64,35.51 21.64,34.9 27.89,28.65 27.89,22.86 R_23.2
N$10
  Top 0.152: CLK_RST.3 19.05,33.53 20.57,35.05 20.57,36.58 21.18,37.19 22.55,37.19 24.08,35.66 CLK_RST.10
  Bottom 0.152: R_26.2 36.73,15.24 36.73,12.95 31.39,7.62 R_25.2 24.08,7.62 24.08,12.04 19.05,17.07 CLK_RST.3
N$11
  Top 0.152: R_28.2 33.07,46.94 33.07,40.69 33.98,39.78 33.98,14.63 31.55,12.19 31.55,9.91 24.23,2.59 SW_CLK_TYPE.1
N$12
  Top 0.152: R_28.1 33.07,39.32 33.07,20.12 C_04.-
  Bottom 0.152: CLK_RST.4 29.41,20.12 32.92,20.12 C_04.-
N$13
  Top 0.152: R_11.1 36.88,28.04 40.54,28.04 R_21.1 40.69,27.89 42.06,27.89 48.92,21.03 48.92,13.72 RESET.2
N$14
  Top 0.152: 45.87,32.77 43.13,35.51 40.69,35.51 R_21.2 | C_03.- 45.87,32.77 | 45.87,32.77 44.5,31.39 44.5,28.04 R_24.1
N$15
  Bottom 0.152: CLK_RST.9 26.67,35.66 27.28,35.66 28.8,37.19 31.09,37.19 33.68,34.59 43.43,34.59 44.35,35.51 R_24.2
N$16
  Bottom 0.152: CLK_RST.1 14.02,28.04 14.63,28.04 20.57,33.98 27.58,33.98 29.11,35.51 CLK_RST.8
N$21
  Top 0.152: JP_CLK_RST.2 13.41,80.01 6.4,73 6.4,52.12 15.24,43.28 15.24,29.26 16.46,28.04 CLK_RST.2
  Bottom 0.152: CLK_RST.2 18.44,29.87 29.72,29.87 34.14,25.45 40.54,25.45 R_RST.2
N$22
  Top 0.152: JP_CLK_RST.1 18.75,80.01 12.04,73.3 7.16,73.3 6.71,72.85 6.71,52.27 15.85,43.13 15.85,36.88 15.54,36.58 15.54,30.94 17.53,28.96 17.53,26.36 16.61,25.45 R_CLK.2
  Bottom 0.152: R_CLK.2 16.61,25.3 16.61,19.05 21.49,14.17 21.49,2.59 SW_CLK_TYPE.2
N$34
  Top 0.152: L_DATA_7.A 36.88,57.15 31.09,62.94 24.69,62.94 R_DATA_7.1
N$35
  Top 0.152: L_DATA_6.A 45.72,57.15 39.62,63.25 28.19,63.25 R_DATA_6.1
N$36  (via drill 0.35)
  Top 0.152: v51.05,60.66 42.67,60.66 39.78,63.55 31.7,63.55 R_DATA_5.1
  Bottom 0.152: v51.05,60.66 54.56,57.15 L_DATA_5.A
N$37
  Top 0.152: L_DATA_4.A 60.05,57.15 55.93,61.27 45.87,61.27 43.28,63.86 35.2,63.86 R_DATA_4.1
N$42  (via drill 0.35)
  Top 0.152: L_DATA_3.A 64.77,57.15 63.86,58.06 63.09,58.06 61.87,56.84 61.87,56.69 61.42,56.24 60.5,56.24 57.91,58.83 v44.96,58.83
  Bottom 0.152: v44.96,58.83 44.04,58.83 R_DATA_3.1
N$43
  Top 0.152: L_DATA_2.A 71.17,57.15 66.75,61.57 46.02,61.57 42.82,64.77 R_DATA_2.1
N$44
  Top 0.152: L_DATA_1.A 79.1,57.15 78.18,56.24 75.74,56.24 74.68,57.3 74.68,57.45 70.26,61.87 48.62,61.87 R_DATA_1.1
N$48
  Bottom 0.152: L_ADDR_0.A 30.48,57.15 23.77,63.86 19.96,63.86 R_ADDR_0.1
N$50
  Top 0.152: L_ADDR_1.A 24.23,57.15 16.61,64.77 R_ADDR_1.1
N$51
  Top 0.152: L_ADDR_2.A 19.05,57.15 R_ADDR_2.1
N$63
  Top 0.152: R_CLK.1 16.61,17.83 20.27,21.49 L_CLK.A
N$64
  Top 0.152: L_RST.A R_RST.1
N$65
  Top 0.152: R_ADDR_3.1 7.62,63.4 13.87,57.15 L_ADDR_3.A
N$66
  Top 0.152: L_DATA_0.A 83.82,57.15 78.79,62.18 52.12,62.18 R_DATA_0.1
N_OUT1  (via drill 0.35)
  Top 0.152: 85.19,31.7 85.19,27.89 88.85,24.23 88.85,17.83 R_OUT_1B.1 | 85.19,31.7 85.19,32.92 R_OUT_1.2 | v29.41,76.96 51.36,76.96 v57,71.32 | v71.48,50.44 71.48,32.61 72.39,31.7 85.19,31.7
  Bottom 0.152: v29.41,76.96 29.87,76.96 32.92,80.01 JP_OUTPUT.1 | v57,71.32 57,64.92 v71.48,50.44
N_OUT2  (via drill 0.35)
  Top 0.152: v25.91,54.71 28.5,54.71 58.83,24.38 58.83,20.42 63.7,15.54 81.69,15.54 86.11,19.96 86.11,20.57 85.19,21.49 85.19,26.67 R_OUT_2.2 | v24.08,81.84 25.3,81.84 25.91,82.45 28.04,82.45 JP_OUTPUT.2
  Bottom 0.152: v25.91,54.71 23.77,56.84 23.77,57.76 17.22,64.31 17.22,74.98 v24.08,81.84
N_OUT3  (via drill 0.35)
  Top 0.152: v25.91,55.63 46.02,55.63 59.44,42.22 59.44,35.81 64.47,30.79 74.68,30.79 85.04,20.42 R_OUT_3.2 | v26.21,81.84 28.04,80.01 JP_OUTPUT.3
  Bottom 0.152: v25.91,55.63 25.91,56.08 17.53,64.47 17.53,74.37 24.99,81.84 v26.21,81.84
N_OUT4
  Bottom 0.152: JP_OUTPUT.4 24.84,80.01 17.83,73 17.83,64.62 49.23,33.22 49.23,30.02 56.08,23.16 57.61,23.16 60.2,20.57 67.06,20.57 74.68,12.95 77.72,12.95 78.64,13.87 85.04,13.87 R_OUT_4.2
N_OUT_1
  Top 0.152: L_OUT_1.A 72.39,32.92 73.76,32.92 74.68,32 76.5,32 77.42,32.92 R_OUT_1.1
N_OUT_1B
  Top 0.152: R_OUT_1B.2 96.47,17.68 96.47,15.09 89,7.62 SG1.-
N_OUT_2
  Top 0.152: L_OUT_2.A 73.61,26.67 74.52,27.58 76.5,27.58 77.42,26.67 R_OUT_2.1
N_OUT_3
  Top 0.152: L_OUT_3.A 72.39,20.42 73.76,20.42 74.68,21.34 76.5,21.34 77.42,20.42 R_OUT_3.1
N_OUT_4
  Top 0.152: L_OUT_4.A 72.39,13.87 73.76,13.87 74.68,12.95 76.5,12.95 77.42,13.87 R_OUT_4.1
N_SW1
  Top 0.152: R_DSW_1.1 57.15,40.69 59.13,38.71 59.13,35.36 64.77,29.72 SW_INPUT.8
  Bottom 0.152: JP_INPUT.1 35.2,80.01 33.38,81.84 27.58,81.84 26.52,80.77 26.52,78.94 20.88,73.3 18.59,73.3 18.14,72.85 18.14,71.93 32,58.06 33.38,58.06 48.16,43.28 57.15,43.28 R_DSW_1.1
N_SW2  (via drill 0.35)
  Top 0.152: SW_INPUT.7 64.77,21.64 60.66,25.76 60.66,33.38 57.15,36.88 R_DSW_2.1 57.15,39.47 v52.73,43.89 | v57.61,76.66 56.39,77.88 49.23,77.88 47.09,80.01 JP_INPUT.2
  Bottom 0.152: v57.61,76.66 48.16,76.66 36.88,65.38 36.88,55.02 48.01,43.89 v52.73,43.89
N_SW3  (via drill 0.35)
  Top 0.152: SW_INPUT.6 64.77,19.36 60.35,23.77 60.35,29.87 57.15,33.07 R_DSW_3.1 57.15,35.66 v45.11,47.7 | JP_INPUT.3 49.84,80.01 51.66,81.84 63.86,81.84 64.62,81.08 64.62,75.44 61.87,72.69 61.87,71.32 61.27,70.71 54.86,70.71 v51.66,73.91
  Bottom 0.152: v51.66,73.91 45.87,73.91 37.19,65.23 37.19,55.63 v45.11,47.7
N_SW4  (via drill 0.35)
  Top 0.152: R_DSW_4.1 57.15,26.52 63.09,20.57 63.09,18.29 64.77,16.61 SW_INPUT.5 | JP_INPUT.4 55.63,80.01 v58.98,76.66
  Bottom 0.152: v58.98,76.66 55.63,73.3 51.82,73.3 44.5,65.99 41.76,65.99 41,65.23 41,64.31 45.87,59.44 47.7,59.44 49.84,57.3 49.84,51.82 58.06,43.59 58.06,32.77 57.15,31.85 R_DSW_4.1
VCC
  Top 0.152: 81.53,43.28 81.23,43.28 77.57,46.94 R_1.2 | PWR.3 83.97,45.72 81.53,43.28 | 81.53,43.28 C_01.+ | SW_INPUT.4 SW_INPUT.3 SW_INPUT.2 SW_INPUT.1 57.15,24.23 46.79,24.23 36.88,34.14 36.88,35.51 R_11.2 | R_10.2 10.21,46.94 10.21,44.5 14.94,39.78 14.94,36.58 14.02,35.66 CLK_RST.14
  Bottom 0.152: R_P01.2 58.98,72.39 61.57,69.8 | 61.57,69.8 68.89,69.8 71.02,71.93 71.02,72.39 ROM.14 | C_PIC.- 86.41,69.49 91.9,69.49 95.25,66.14 PICCON.2 95.25,65.68 92.81,63.25 92.81,45.72 PWR.3 | 61.57,69.8 61.57,67.36 60.05,65.84 60.05,63.09 76.05,47.09 | 76.05,47.09 77.42,47.09 R_1.2 | C_05.+ 8.99,30.79 13.87,35.66 CLK_RST.14 14.02,35.66 15.85,37.49 31.24,37.49 33.07,35.66 36.73,35.66 R_11.2 | R_10.2 6.4,50.75 6.4,80.01 JP_POWER.2 | 76.05,47.09 76.05,44.35 57.15,25.45 SW_INPUT.1

### Text on the board
Top: ROM/CLK/RST/INPUT/OUTPUT/PWR